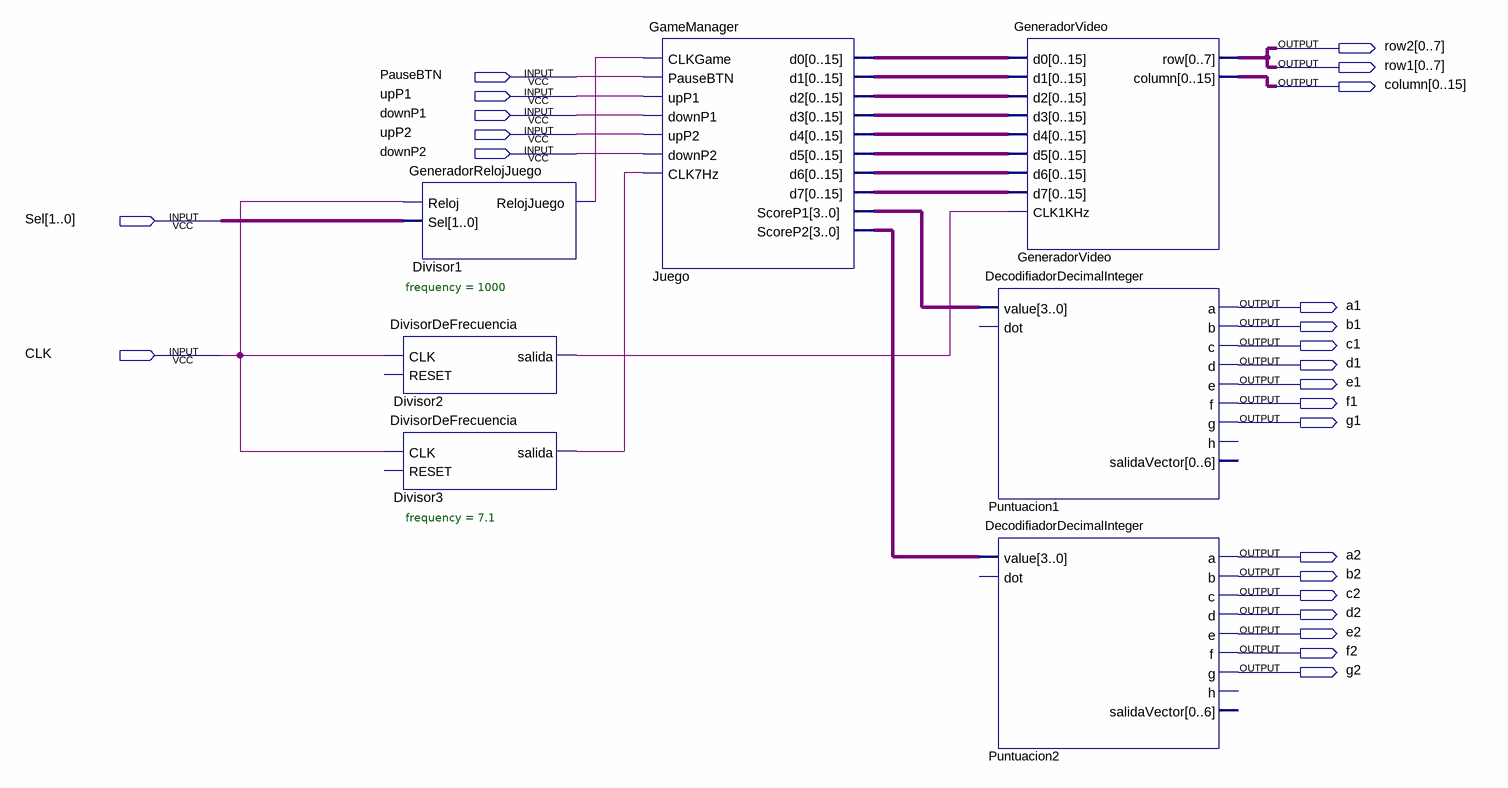
[diagram p0: schematic sheet]
// Quartus schematic Practica8.bdf as structural Verilog: 7 symbols, 24 pins
module Practica8 (
  input  PauseBTN,
  input  upP1,
  input  downP1,
  input  upP2,
  input  downP2,
  input  [1:0] Sel,
  input  CLK,
  output [0:7] row2,
  output [0:7] row1,
  output [0:15] column,
  output a1,
  output b1,
  output c1,
  output d1,
  output e1,
  output f1,
  output g1,
  output a2,
  output b2,
  output c2,
  output d2,
  output e2,
  output f2,
  output g2
);

  wire Divisor1_relojjuego, Divisor2_salida, Divisor3_salida;
  wire [3:0] Juego_scorep1, Juego_scorep2;
  wire [15:0] Juego_d0, Juego_d1, Juego_d2, Juego_d3, Juego_d4, Juego_d5, Juego_d6, Juego_d7;

  DivisorDeFrecuencia #(.frequency(1000)) Divisor2 (.CLK(CLK), .salida(Divisor2_salida));  // open: RESET
  DivisorDeFrecuencia #(.frequency(7.1)) Divisor3 (.CLK(CLK), .salida(Divisor3_salida));  // open: RESET
  GeneradorRelojJuego Divisor1 (.Reloj(CLK), .Sel(Sel), .RelojJuego(Divisor1_relojjuego));
  GameManager Juego (
    .CLKGame(Divisor1_relojjuego), .PauseBTN(PauseBTN), .upP1(upP1), .downP1(downP1), .upP2(upP2),
    .downP2(downP2), .CLK7Hz(Divisor3_salida), .d0(Juego_d0), .d1(Juego_d1), .d2(Juego_d2), .d3(Juego_d3),
    .d4(Juego_d4), .d5(Juego_d5), .d6(Juego_d6), .d7(Juego_d7), .ScoreP1(Juego_scorep1),
    .ScoreP2(Juego_scorep2));
  GeneradorVideo GeneradorVideo (
    .d0(Juego_d0), .d1(Juego_d1), .d2(Juego_d2), .d3(Juego_d3), .d4(Juego_d4), .d5(Juego_d5), .d6(Juego_d6),
    .d7(Juego_d7), .CLK1KHz(Divisor2_salida), .row(row1), .column(column));
  DecodifiadorDecimalInteger Puntuacion1 (
    .value(Juego_scorep1), .a(a1), .b(b1), .c(c1), .d(d1), .e(e1), .f(f1), .g(g1));  // open: dot, h, salidaVector
  DecodifiadorDecimalInteger Puntuacion2 (
    .value(Juego_scorep2), .a(a2), .b(b2), .c(c2), .d(d2), .e(e2), .f(f2), .g(g2));  // open: dot, h, salidaVector

  assign row2 = row1;
endmodule
